# Altium schematic sheet Block_Diagram.SchDoc
size A4; SheetNumber: 3; SheetTotal: 3
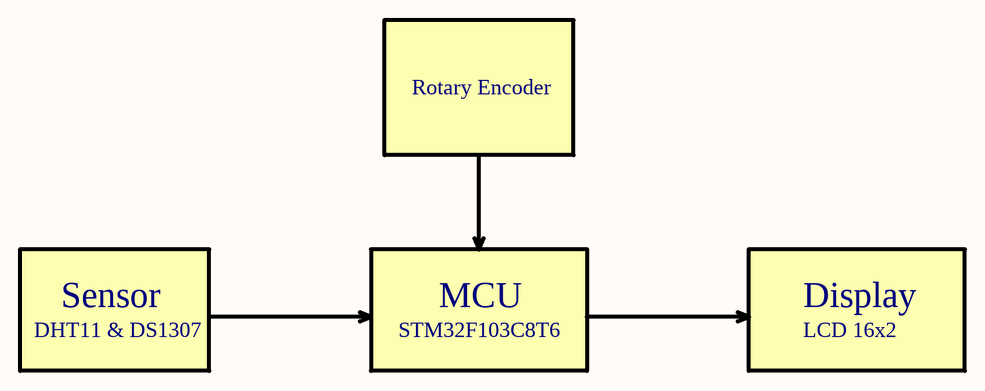
[diagram p0: Block_Diagram.SchDoc]

## Notes on the sheet
- Rotary Encoder
- Sensor
- MCU
- Display
- DHT11 & DS1307
- STM32F103C8T6
- LCD 16x2
- Title
- Size
- A4
- Number
- Revision
- Date:
- Drawn By: Quoc Thang
- Time:
- Checked By:
- File: D\Altium\Templates